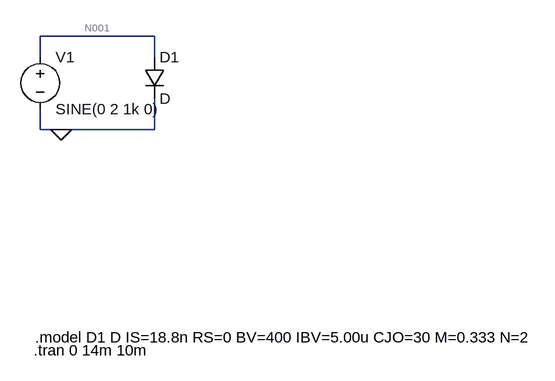
[diagram p0: schematic Draft2.asc]
Draft2.asc, the LTspice schematic file:
Version 4
SHEET 1 1044 680
WIRE 272 -160 96 -160
WIRE 96 -128 96 -160
WIRE 272 -128 272 -160
WIRE 96 -16 96 -48
WIRE 128 -16 96 -16
WIRE 272 -16 272 -64
WIRE 272 -16 128 -16
FLAG 128 -16 0
SYMBOL diode 256 -128 R0
SYMATTR InstName D1
SYMBOL voltage 96 -144 R0
WINDOW 123 0 0 Left 2
WINDOW 39 0 0 Left 2
SYMATTR InstName V1
SYMATTR Value SINE(0 2 1k 0)
TEXT 88 304 Left 2 !.model D1 D IS=18.8n RS=0 BV=400 IBV=5.00u CJO=30 M=0.333 N=2
TEXT 86 324 Left 2 !.tran 0 14m 10m

The netlist it stands for:
* Draft2.asc
D1 N001 0 D
V1 N001 0 SINE(0 2 1k 0)
.model D D
.lib standard.dio
.model D1 D IS=18.8n RS=0 BV=400 IBV=5.00u CJO=30 M=0.333 N=2
.tran 0 14m 10m
.backanno
.end

* Results of the author's LTspice run, read from the files saved beside the schematic
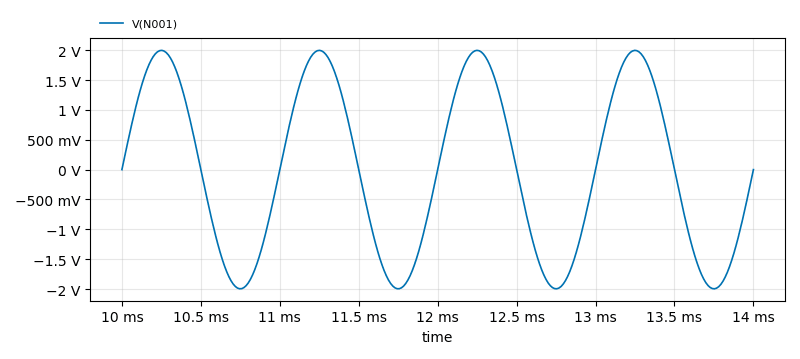
[diagram p1: Transient Analysis of Draft2.asc, plotted from the saved traces]
* Transient Analysis, 1 run:
*   V(N001): min -1.996 V, max 1.996 V, average 723.2 nV, rms 1.412 V, last 0 V